# Altium project tPad_Yeongmi.PrjPcb
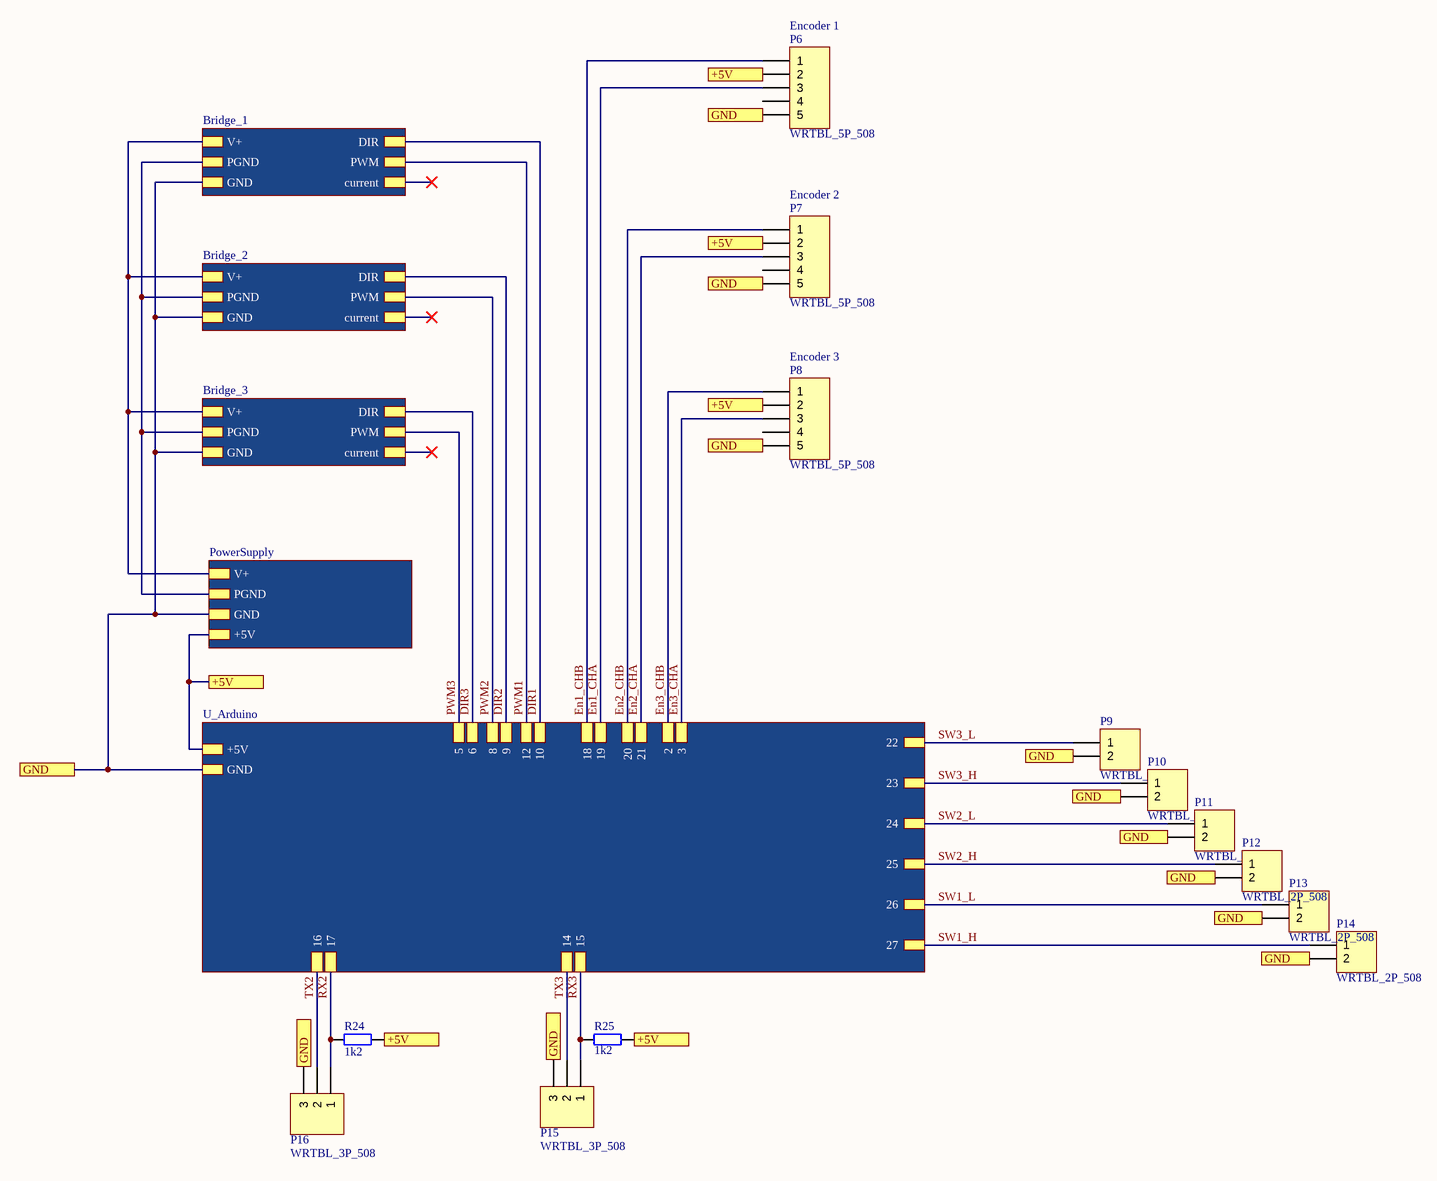
[diagram p0: Overview.SchDoc]
4 sheets, 136 parts. Net scope: hierarchical (ports join the sheet entries above them; power ports are global).
Board file: tPad_Yeongmi.PcbDoc
Sheets:
  Overview.SchDoc
    PowerSupply = PowerSupply.SchDoc
    Bridge_1 = OutputStage.SchDoc
    Bridge_2 = OutputStage.SchDoc
    Bridge_3 = OutputStage.SchDoc
    U_Arduino = Arduino.SchDoc

## Sheet Overview.SchDoc
size A3; Organization: MCI; SheetNumber: 1; SheetTotal: 1

### Parts
P6  WRTBL_5P_508  [WRTBL_5P_508]
P7  WRTBL_5P_508  [WRTBL_5P_508]
P8  WRTBL_5P_508  [WRTBL_5P_508]
P9  WRTBL_2P_508  [WRTBL_2P_508]
P10  WRTBL_2P_508  [WRTBL_2P_508]
P11  WRTBL_2P_508  [WRTBL_2P_508]
P12  WRTBL_2P_508  [WRTBL_2P_508]
P13  WRTBL_2P_508  [WRTBL_2P_508]
P14  WRTBL_2P_508  [WRTBL_2P_508]
P15  WRTBL_3P_508  [WRTBL_3P_508]
P16  WRTBL_3P_508  [WRTBL_3P_508]
R24  1k2  [_0603]
R25  1k2  [_0603]

### Sub-sheets
Bridge_1 = OutputStage.SchDoc: DIR, PWM, current, V+, PGND, GND
Bridge_2 = OutputStage.SchDoc: DIR, PWM, current, V+, PGND, GND
Bridge_3 = OutputStage.SchDoc: DIR, PWM, current, V+, PGND, GND
PowerSupply = PowerSupply.SchDoc: V+, +5V, GND, PGND
U_Arduino = Arduino.SchDoc: +5V, GND, 16, 17, 9, 12, 23, 2, 10, 8, 15, 3, 26, 25, 19, 24, 18, 27, 6, 22, 20, 5, 21, 14

### Ports
+5V, GND

### Nets
5V: P6.2 P7.2 P8.2 R24.2 R25.2 ; port +5V, sheet PowerSupply/+5V, sheet U_Arduino/+5V
GND: P6.5 P7.5 P8.5 P9.2 P10.2 P11.2 P12.2 P13.2 P14.2 P15.3 P16.3 ; port GND, sheet PowerSupply/GND, sheet Bridge_1/GND, sheet Bridge_2/GND, sheet Bridge_3/GND, sheet U_Arduino/GND
PGND: sheet PowerSupply/PGND, sheet Bridge_1/PGND, sheet Bridge_2/PGND, sheet Bridge_3/PGND
DIR1: sheet Bridge_1/DIR, sheet U_Arduino/10
DIR2: sheet Bridge_2/DIR, sheet U_Arduino/9
DIR3: sheet Bridge_3/DIR, sheet U_Arduino/6
En1_CHA: P6.3 ; sheet U_Arduino/19
En1_CHB: P6.1 ; sheet U_Arduino/18
En2_CHA: P7.3 ; sheet U_Arduino/21
En2_CHB: P7.1 ; sheet U_Arduino/20
En3_CHA: P8.3 ; sheet U_Arduino/3
En3_CHB: P8.1 ; sheet U_Arduino/2
PWM1: sheet Bridge_1/PWM, sheet U_Arduino/12
PWM2: sheet Bridge_2/PWM, sheet U_Arduino/8
PWM3: sheet Bridge_3/PWM, sheet U_Arduino/5
RX2: P16.1 R24.1 ; sheet U_Arduino/17
RX3: P15.1 R25.1 ; sheet U_Arduino/15
SW1_H: P14.1 ; sheet U_Arduino/27
SW1_L: P13.1 ; sheet U_Arduino/26
SW2_H: P12.1 ; sheet U_Arduino/25
SW2_L: P11.1 ; sheet U_Arduino/24
SW3_H: P10.1 ; sheet U_Arduino/23
SW3_L: P9.1 ; sheet U_Arduino/22
TX2: P16.2 ; sheet U_Arduino/16
TX3: P15.2 ; sheet U_Arduino/14
V+: sheet PowerSupply/V+, sheet Bridge_1/V+, sheet Bridge_2/V+, sheet Bridge_3/V+

Not connected (* = marked no-connect by the designer): P6 4; P7 4; P8 4

### Notes on the sheet
- (near P6) Encoder 1
- (near P7) Encoder 2
- (near P8) Encoder 3
- Project
- Date:
- Drawn by:
- Time:
- Number:
- Revision:
- Sheet
- of
- ELECTRONICS
- File:

### Library data of the parts
P6-P8 = Con_10: QR: 0; UID: Con_10; Name: WRTBL_5P_508; mounting: THT; Pins: 5
P9-P14 = Con_7: RS_number: 193-0586; QR: 0; UID: Con_7; Name: WRTBL_2P_508; Name_Hyperlink: Printklemme 5,08mm 2-polig; ComponentLink1URL: http://at.rs-online.com/web/search/searchBrowseAction.html?method=getProduct&R=1930586; mounting: THT; Pins: 2
P15 P16 = Con_8: QR: 0; UID: Con_8; Name: WRTBL_3P_508; mounting: THT; Pins: 3
R24 R25 = Res_5: Name: Res_0603; UID: Res_5; ComponentLink1URL: #VALUE!; mounting: SMD

## Sheet PowerSupply.SchDoc
size A3; Organization: MCI; SheetNumber: 1; SheetTotal: 1
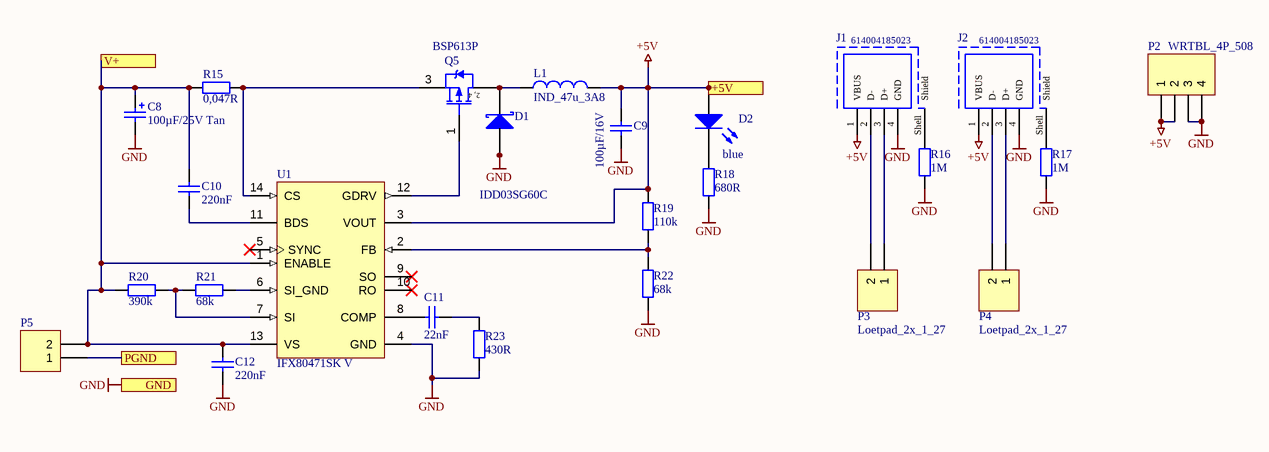
[diagram p1: PowerSupply.SchDoc]

### Parts
C8  100µF/25V Tan  [C]
C9  100µF/16V  [_1210]
C10  220nF  [_0805]
C11  22nF  [_0603]
C12  220nF  [_0805]
D1  IDD03SG60C  [TO_252]
D2  blue  [LED_0603]
J1  614004185023  [614004185023]
J2  614004185023  [614004185023]
L1  IND_47u_3A8  [WE_PD_XXL]
P2  WRTBL_4P_508  [WRTBL_4P_508]
P3  Loetpad_2x_1_27  [Loetpad_2x_1_27]
P4  Loetpad_2x_1_27  [Loetpad_2x_1_27]
P5  WRTBL_2P_508  [WRTBL_2P_508]  (value not drawn)
Q5  BSP613P  [INF-PG-SOT223_SC-73_N]
R15  0,047R  [_1206]
R16  1M  [_0603]
R17  1M  [_0603]
R18  680R  [_0603]
R19  110k  [_0603]
R20  390k  [_0603]
R21  68k  [_0603]
R22  68k  [_0603]
R23  430R  [_0603]
U1  IFX80471SK V  [INF-PG-DSO-14-1_N]

### Ports
+5V, GND, PGND, V+

### Nets
+5V: C9.2 D2.1 J1.1(VBUS) J2.1(VBUS) L1.2 P2.1 P2.2 R19.2 U1.3(VOUT) ; port +5V  [project net 5V]
GND: C8.2 C9.1 C12.1 D1.1 D1.2 J1.4(GND) J2.4(GND) P2.3 P2.4 R16.1 R17.1 R18.1 R22.1 R23.2 U1.4(GND) ; port GND
PGND: P5.1 ; port PGND
V+: C8.1 C10.2 C12.2 P5.2 R15.1 R20.1 U1.1(ENABLE) U1.13(VS) ; port V+
NetC10_1: C10.1 U1.11(BDS)
NetC11_1: C11.1 U1.8(COMP)
NetC11_2: C11.2 R23.1
NetD1_3: D1.3 L1.1 Q5.2(DRAIN) Q5.4(DRAIN)
NetD2_2: D2.2 R18.2
NetJ1_2: J1.2(D-) P3.2
NetJ1_3: J1.3(D+) P3.1
NetJ1_Shell: J1.Shell(Shield) R16.2
NetJ2_2: J2.2(D-) P4.2
NetJ2_3: J2.3(D+) P4.1
NetJ2_Shell: J2.Shell(Shield) R17.2
NetQ5_1: Q5.1(GATE) U1.12(GDRV)
NetQ5_3: Q5.3(SOURCE) R15.2 U1.14(CS)
NetR19_1: R19.1 R22.2 U1.2(FB)
NetR20_2: R20.2 R21.1 U1.7(SI)
NetR21_2: R21.2 U1.6(SI_GND)

Not connected (* = marked no-connect by the designer): U1 5(SYNC)* 9(SO)* 10(RO)*

### Notes on the sheet
- Project
- Date:
- Drawn by:
- Time:
- Number:
- Revision:
- Sheet
- of
- ELECTRONICS
- File:
- (in symbol Tran_33) 2, 4

### Library data of the parts
C8 = Cap_56: Name: Cap_tan_47u_25V; RS_number: 684-5284P; QR: 1; Capacity: 47u; Voltage: 25v; UID: Cap_56; Name_Hyperlink: Capacitor Tantalum SMT TR3D 25V 47uF; mounting: SMD
C9 = Cap_65: Name: Cap_1210; Capacity: ?F; Voltage: ?V; UID: Cap_65; mounting: SMD
C10 C12 = Cap_63: Name: Cap_0805; Capacity: ?F; Voltage: ?V; UID: Cap_63; mounting: SMD
C11 = Cap_129: Name: Cap_0603; QR: 0; UID: Cap_129; mounting: SMD
D1 = DIODE_12: Type: Schottky; Current / Power: 3.5 A; RS_number: 300-357P; QR: 0; UID: DIODE_12; Name: 30WQ06FN; Name_Hyperlink: Diode 30WQ06FN; mounting: SMD
D2 = DIODE_60: Name: LED_0603_blau; Colour: blau; RS_number: 697-3610P; QR: 0; UID: DIODE_60; Type: LED; Name_Hyperlink: http://at.rs-online.com/web/p/products/6973610P/; mounting: SMD
J1 J2 = 614004185023: USB 2.0 Type A Receptacle WR-COM, Vertical, THT, Short Type; Rated Current: 1.5 A; Contact Resistance: 30 mOhm; Working Voltage: 30 VAC; ComponentLink1Description: Manufacturer; ComponentLink1URL: http://www.we-online.de; ComponentLink2Description: Datasheet; ComponentLink2URL: https://katalog.we-online.de/em/datasheet/614004185023.pdf; Part Number: 614004185023; Published Date: September 2018; Publisher: Wurth Elektronik; Orientation: Vertical; Connector Type: USB 2.0 Type A; Operating Temperature: -55 to 85 degC; Mounting Technology: THT; Gender: Receptacle; Packaging: Tray
L1 = Ind_8: Inductor; Wuerth_number: 744 7709 470; QR: 0; Inductivity: 47 uH; Current: 3.8 A; UID: Ind_8; Name: IND_47u_3A8; mounting: SMD
P2 = Con_9: QR: 0; UID: Con_9; Name: WRTBL_4P_508; mounting: THT; Pins: 4
P3 P4 = Con_77: UID: Con_77; Name: Loetpad_2x_1_27; mounting: THT
P5 = Con_7: RS_number: 193-0586; QR: 0; UID: Con_7; Name: WRTBL_2P_508; Name_Hyperlink: Printklemme 5,08mm 2-polig; ComponentLink1URL: http://at.rs-online.com/web/search/searchBrowseAction.html?method=getProduct&R=1930586; mounting: THT; Pins: 2
Q5 = Tran_33: P-Channel SIPMOS Small-Signal-Transistor, -60 V VDS, -2.9 A ID, -55 to 150 degC, PG-SOT223 (SC-73), Reel, Green; Manufacturer: Infineon; Green: TRUE; ID (max): -2.9 A; IDpuls (max): -11.6 A; Mode: Enhancement; Polarity: P; Pto t (max): 1.8 W; QG: -22 nC; RDS (on) (max): 130 mOhm; Rth: 100 K/W; VDS (max): -60 V; VGS(th) (max): -4 V; VGS(th) (min): -2.1 V; DatasheetVersion: Rev. 2.7; PackageVersion: Apr-08; PackageReference: PG-SOT223 (SC-73); PackageDescription: 4-Pin Small Outline Transistor Package, 6.5 x 3.5 mm Body, 2.3 mm Pitch; Supplier 1: Digi-Key; Supplier Part Number 1: BSP613P-ND; Halogen-free: TRUE; Packing: Reel; Technology: SIPMOS; Mounting Technology: Surface Mount; PartNumber: BSP613P; ComponentLink1Description: Manufacturer URL; ComponentLink1URL: http://www.infineon.com/; ComponentLink2Description: Datasheet; ComponentLink2URL: http://www.infineon.com/dgdl/BSP613P_Rev2.7.pdf?folderId=db3a304314dca38901154a72e3951a65&fileId=db3a30433b47825b013b60ac86a96dc0; ComponentLink3Description: Package Specification; ComponentLink3URL: http://www.infineon.com/dgdl/SOT223-Package_Overview.pdf?folderId=db3a30431936bc4b0119530470b03c3d&fileId=db3a30431936bc4b0119531d40b93c5c; UID: Tran_33; Name: BSP613P; mounting: SMD; Type: P
R15 = Res_7: Name: Res_1206; UID: Res_7; mounting: SMD
R16-R23 = Res_5: Name: Res_0603; UID: Res_5; mounting: SMD
U1 = IFX80471SK V: Step-Down DC/DC Controller, 2,300 mA Iq, -40 to 125 degC, PG-DSO-14-1, Reel, Green; Manufacturer: Infineon; Green: TRUE; Iq (typ): 130 uA; Max Number Reflow: 3; Max Peak Reflow Temp: 260 degC; Output: Buck Converter; Tolerance: 3(5)%; VQ (max): adjustable; DatasheetVersion: Rev. 1.0; PackageVersion: Apr-11; PackageReference: PG-DSO-14-1; PackageDescription: 14-Pin Plastic (Green) Dual Small Outline Package, 8.65 x 3.9 mm Body, 1.27 mm Pitch; Supplier 1: Digi-Key; Supplier Part Number 1: IFX80471SK VINTR-ND; Supplier 2: Digi-Key; Supplier Part Number 2: IFX80471SK VINCT-ND; Supplier 3: Digi-Key; Supplier Part Number 3: IFX80471SK VINDKR-ND; Supplier 4: Mouser; Supplier Part Number 4: 726-IFX80471SKV; Halogen-free: TRUE; Inhibit: TRUE; IQ (max): 2,300 mA; MSL: 3; Packing: Reel; Protect: TRUE; Reset: TRUE; Mounting Technology: Surface Mount; PartNumber: IFX80471SK V; ComponentLink1Description: Manufacturer URL; ComponentLink1URL: http://www.infineon.com/; ComponentLink2Description: Datasheet; ComponentLink2URL: http://www.infineon.com/dgdl/DCDC-Controller-IFX80471-Data-Sheet-V10-Infineon.pdf?folderId=db3a304314dca3890115039cf70d0bf0&fileId=db3a30432e398416012e487ec6e42599; ComponentLink3Description: Package Specification; ComponentLink3URL: http://www.infineon.com/dgdl/DCDC-Controller-IFX80471-Data-Sheet-V10-Infineon.pdf?folderId=db3a304314dca3890115039cf70d0bf0&fileId=db3a30432e398416012e487ec6e42599

## Sheet OutputStage.SchDoc
size A3; Organization: MCI; SheetNumber: 1; SheetTotal: 1
Used 3 times, as channels Bridge_1, Bridge_2, Bridge_3. Parts and nets are listed once, with the designators drawn on the sheet.
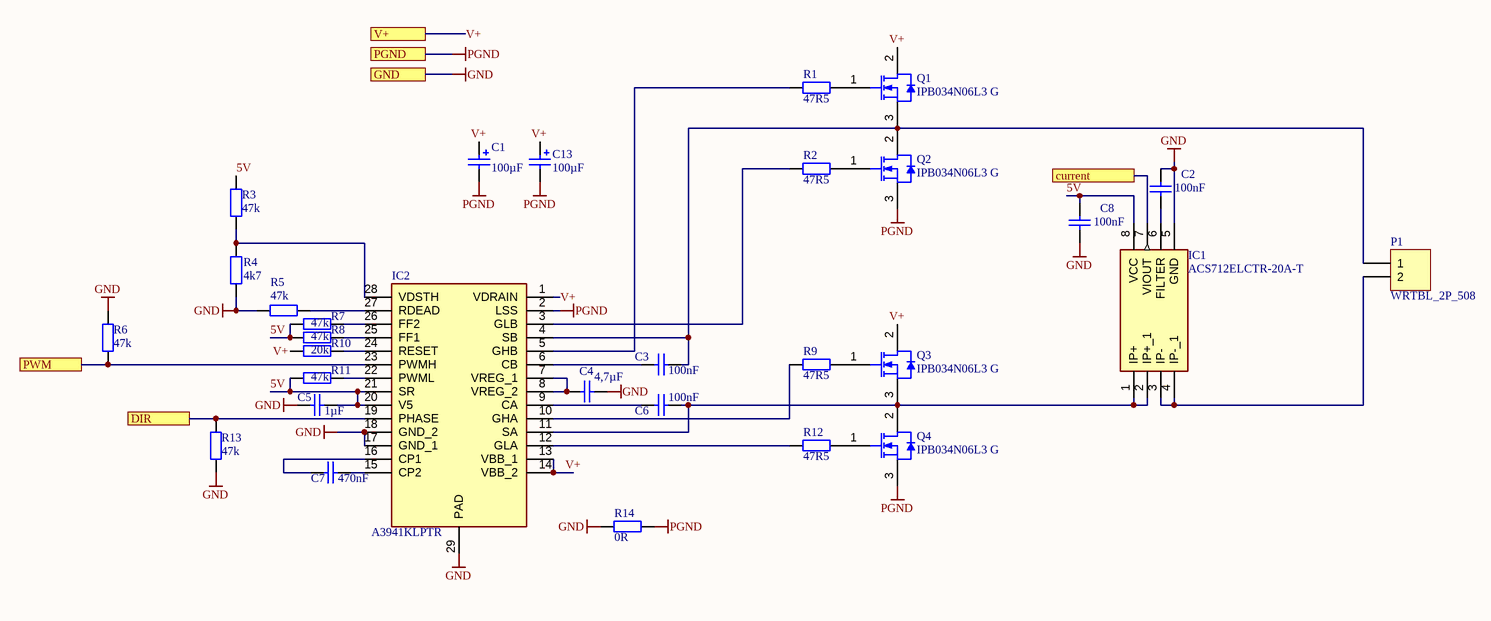
[diagram p2: OutputStage.SchDoc]

### Parts
C1  100µF  [Cap_THT_Elko_rad_D8mm]
C2  100nF  [_0603]
C3  100nF  [_0603]
C4  4,7µF  [_0603]
C5  1µF  [_0805]
C6  100nF  [_0603]
C7  470nF  [_0603]
C8  100nF  [_0603]
C13  100µF  [Cap_THT_Elko_rad_D8mm]
IC1  ACS712ELCTR-20A-T  [SOIC127P600X175-8N]
IC2  A3941KLPTR  [SOP65P640X120-29N]
P1  WRTBL_2P_508  [WRTBL_2P_508]
Q1  IPB034N06L3 G  [INF-PG-TO-263-3-2_A_N]
Q2  IPB034N06L3 G  [INF-PG-TO-263-3-2_A_N]
Q3  IPB034N06L3 G  [INF-PG-TO-263-3-2_A_N]
Q4  IPB034N06L3 G  [INF-PG-TO-263-3-2_A_N]
R1  47R5  [_0603]
R2  47R5  [_0603]
R3  47k  [_0603]
R4  4k7  [_0603]
R5  47k  [_0603]
R6  47k  [_0603]
R7  47k  [_0603]
R8  47k  [_0603]
R9  47R5  [_0603]
R10  20k  [_0603]
R11  47k  [_0603]
R12  47R5  [_0603]
R13  47k  [_0603]
R14  0R  [_0603]

### Ports
current, DIR, GND, PGND, PWM, V+

### Nets
GND: C2.2 C4.2 C5.1 C8.1 IC1.5(GND) IC2.17(GND_1) IC2.18(GND_2) IC2.29(PAD) R4.2 R5.2 R6.1 R13.2 R14.2 ; port GND
PGND: C1.2 C13.2 IC2.2(LSS) Q2.3(SOURCE) Q4.3(SOURCE) R14.1 ; port PGND
5V: C5.2 C8.2 IC1.8(VCC) IC2.20(V5) IC2.21(SR) R3.1 R7.2 R8.2 R11.2
current: IC1.7(VIOUT) ; port current
DIR: IC2.19(PHASE) R13.1 ; port DIR
PWM: IC2.23(PWMH) R6.2 ; port PWM
V+: C1.1 C13.1 IC2.1(VDRAIN) IC2.13(VBB_1) IC2.14(VBB_2) Q1.2(DRAIN) Q3.2(DRAIN) R10.2 ; port V+
NetC2_1: C2.1 IC1.6(FILTER)
NetC3_1: C3.1 IC2.6(CB)
NetC3_2: C3.2 IC2.4(SB) P1.1 Q1.3(SOURCE) Q2.2(DRAIN)
NetC4_1: C4.1 IC2.7(VREG_1) IC2.8(VREG_2)
NetC6_1: C6.1 IC2.9(CA)
NetC6_2: C6.2 IC1.1(IP+) IC1.2(IP+_1) IC2.11(SA) Q3.3(SOURCE) Q4.2(DRAIN)
NetC7_1: C7.1 IC2.16(CP1)
NetC7_2: C7.2 IC2.15(CP2)
NetIC1_3: IC1.3(IP-) IC1.4(IP-_1) P1.2
NetIC2_3: IC2.3(GLB) R2.2
NetIC2_5: IC2.5(GHB) R1.2
NetIC2_10: IC2.10(GHA) R9.2
NetIC2_12: IC2.12(GLA) R12.2
NetIC2_22: IC2.22(PWML) R11.1
NetIC2_24: IC2.24(RESET) R10.1
NetIC2_25: IC2.25(FF1) R8.1
NetIC2_26: IC2.26(FF2) R7.1
NetIC2_27: IC2.27(RDEAD) R5.1
NetIC2_28: IC2.28(VDSTH) R3.2 R4.1
NetQ1_1: Q1.1(GATE) R1.1
NetQ2_1: Q2.1(GATE) R2.1
NetQ3_1: Q3.1(GATE) R9.1
NetQ4_1: Q4.1(GATE) R12.1

### Channels
Bridge_1: designators end in _1; ports current=NetIC1_1_7 DIR=DIR1 GND=GND PGND=PGND PWM=PWM1 V+=V+
Bridge_2: designators end in _2; ports current=NetIC1_2_7 DIR=DIR2 GND=GND PGND=PGND PWM=PWM2 V+=V+
Bridge_3: designators end in _3; ports current=NetIC1_3_7 DIR=DIR3 GND=GND PGND=PGND PWM=PWM3 V+=V+

### Notes on the sheet
- Project
- Date:
- Drawn by:
- Time:
- Number:
- Revision:
- Sheet
- of
- ELECTRONICS
- File:

### Library data of the parts
C1 C13 = Cap_15: Name: Cap_Elko_rad_100u_35V; RS_number: 228-6767; QR: 1; ax_rad: rad; Capacity: 100u; Voltage: 35V; UID: Cap_15; Name_Hyperlink: Elko 100µF 35VDC; ComponentLink1URL: http://de.rs-online.com/web/search/searchBrowseAction.html?method=getProduct&R=2286767; mounting: THT
C2-C4 C6-C8 = Cap_129: Name: Cap_0603; QR: 0; UID: Cap_129; mounting: SMD
C5 = Cap_128: Name: Cap_0805; QR: 0; UID: Cap_128; ComponentLink1URL: #VALUE!; mounting: SMD
IC1 = ACS712ELCTR-20A-T: Integrated Circuit; Manufacturer_Name: Allegro Microsystems; Allied_Number: R1076682; Datasheet Link: http://uk.rs-online.com/web/p/products/6807135P; Height: 1.75mm; RS Part Number: 6807135P; RS Price/Stock: http://uk.rs-online.com/web/p/products/6807135P; Manufacturer_Part_Number: ACS712ELCTR-20A-T
IC2 = A3941KLPTR: Integrated Circuit; Manufacturer_Name: Allegro Microsystems; Datasheet Link: http://uk.rs-online.com/web/p/products/7248704; Height: 1.2mm; Manufacturer_Part_Number: A3941KLPTR; RS Part Number: 7248704P; RS Price/Stock: http://uk.rs-online.com/web/p/products/7248704P
P1 = Con_7: RS_number: 193-0586; QR: 0; UID: Con_7; Name: WRTBL_2P_508; Name_Hyperlink: Printklemme 5,08mm 2-polig; ComponentLink1URL: http://at.rs-online.com/web/search/searchBrowseAction.html?method=getProduct&R=1930586; mounting: THT; Pins: 2
Q1-Q4 = IPB034N06L3 G: N-Channel OptiMOS 3 Power-Transistor, 60 V VDS, 90 A ID, -55 to 175 degC, PG-TO-263-3-2, Reel, Green; Manufacturer: Infineon; Green: TRUE; ID (max): 90 A; IDpuls (max): 360 A; Polarity: N; Ptot (max): 167 W; QG: 59 nC; RDS (on) (max): 3.7 mOhm; RDS (on) (max) (@4.5V): 5.7 mOhm; Rth: 0.9 K/W; RthJA (max): 62 K/W; VDS (max): 60 V; VGS(th) (max): 2.2 V; VGS(th) (min): 1.2 V; DatasheetVersion: Rev. 2.7; PackageVersion: Rev. 01, 08/2007; PackageReference: PG-TO-263-3-2; PackageDescription: 3-Pin Plastic (Green) Transistor Single Outline Package, 10.06 x 8.98 mm Body, 2.54 mm Pitch; Supplier 1: Digi-Key; Supplier Part Number 1: IPB034N06L3 GTR-ND; Supplier 2: Digi-Key; Supplier Part Number 2: IPB034N06L3 GCT-ND; Supplier 3: Digi-Key; Supplier Part Number 3: IPB034N06L3 GDKR-ND; Supplier 4: Mouser; Supplier Part Number 4: 726-IPB034N06L3G; Halogen-free: TRUE; Packing: Reel; RthJC (max): 0.9 K/W; Mounting Technology: Surface Mount; PartNumber: IPB034N06L3 G; ComponentLink1Description: Manufacturer URL; ComponentLink1URL: http://www.infineon.com/; ComponentLink2Description: Datasheet; ComponentLink2URL: http://www.infineon.com/dgdl/IPP037N06L3_Rev2.7.pdf?folderId=db3a304313b8b5a60113cee8763b02d7&fileId=db3a30431b3e89eb011b4561341f7d38; ComponentLink3Description: Package Specification; ComponentLink3URL: http://www.infineon.com/dgdl/IPB026N06N_Rev2.2.pdf?folderId=db3a304313b8b5a60113cee8763b02d7&fileId=db3a3043372d5cc8013754c7b2a74f7c
R1-R14 = Res_5: Name: Res_0603; UID: Res_5; mounting: SMD

## Sheet Arduino.SchDoc
size A3; Organization: MCI; SheetNumber: 1; SheetTotal: 1
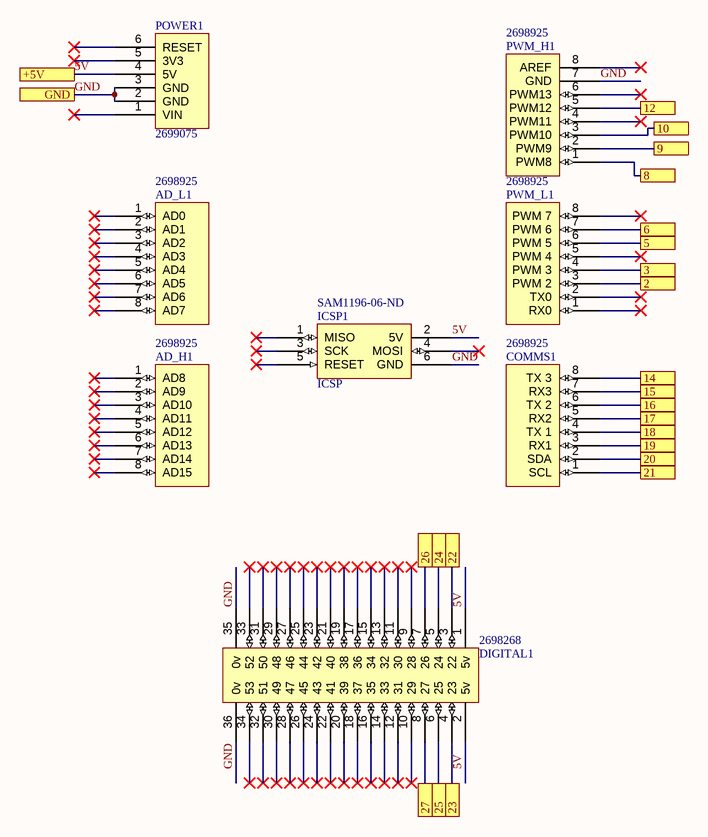
[diagram p3: Arduino.SchDoc]

### Parts
AD_H1  Supplier Part Number 4: 2698925  [Header 8x1 8.5mm]  (hidden comment: AD_H)
AD_L1  Supplier Part Number 5: 2698925  [Header 8x1 8.5mm]  (hidden comment: AD_L)
COMMS1  Supplier Part Number 4: 2698925  [Header 8x1 8.5mm]  (hidden comment: Communication)
DIGITAL1  Supplier Part Number 5: 2698268  [HEADER 36X 8MM]  (hidden comment: IO_36)
ICSP1  ICSP  Supplier Part Number 5: SAM1196-06-ND  [ICSP]
POWER1  Supplier Part Number 2: 2699075  [Header 6x1 8.5mm]  (hidden comment: POWER)
PWM_H1  Supplier Part Number 4: 2698925  [Header 8x1 8.5mm]  (hidden comment: PWM_H)
PWM_L1  Supplier Part Number 4: 2698925  [Header 8x1 8.5mm]  (hidden comment: PWM_L)

### Ports
2, 3, 5, 6, 8, 9, 10, 12, 14, 15, 16, 17, 18, 19, 20, 21, 22, 23, 24, 25, 26, 27, +5V, GND

### Nets
5V: DIGITAL1.1(5v) DIGITAL1.2(5v) ICSP1.2(5V) POWER1.4(5V) ; port +5V
GND: DIGITAL1.35(0v) DIGITAL1.36(0v) ICSP1.6(GND) POWER1.2(GND) POWER1.3(GND) PWM_H1.7(GND) ; port GND
DIR1: PWM_H1.3(PWM10) ; port 10
DIR2: PWM_H1.2(PWM9) ; port 9
DIR3: PWM_L1.7(PWM_6) ; port 6
En1_CHA: COMMS1.3(RX1) ; port 19
En1_CHB: COMMS1.4(TX_1) ; port 18
En2_CHA: COMMS1.1(SCL) ; port 21
En2_CHB: COMMS1.2(SDA) ; port 20
En3_CHA: PWM_L1.4(PWM_3) ; port 3
En3_CHB: PWM_L1.3(PWM_2) ; port 2
PWM1: PWM_H1.5(PWM12) ; port 12
PWM2: PWM_H1.1(PWM8) ; port 8
PWM3: PWM_L1.6(PWM_5) ; port 5
RX2: COMMS1.5(RX2) ; port 17
RX3: COMMS1.7(RX3) ; port 15
SW1_H: DIGITAL1.8(27) ; port 27
SW1_L: DIGITAL1.7(26) ; port 26
SW2_H: DIGITAL1.6(25) ; port 25
SW2_L: DIGITAL1.5(24) ; port 24
SW3_H: DIGITAL1.4(23) ; port 23
SW3_L: DIGITAL1.3(22) ; port 22
TX2: COMMS1.6(TX_2) ; port 16
TX3: COMMS1.8(TX_3) ; port 14

Not connected (* = marked no-connect by the designer): AD_H1 1(AD8)* 2(AD9)* 3(AD10)* 4(AD11)* 5(AD12)* 6(AD13)* 7(AD14)* 8(AD15)*; AD_L1 1(AD0)* 2(AD1)* 3(AD2)* 4(AD3)* 5(AD4)* 6(AD5)* 7(AD6)* 8(AD7)*; DIGITAL1 9(28)* 10(29)* 11(30)* 12(31)* 13(32)* 14(33)* 15(34)* 16(35)* 17(36)* 18(37)* 19(38)* 20(39)* 21(40)* 22(41)* 23(42)* 24(43)* 25(44)* 26(45)* 27(46)* 28(47)* 29(48)* 30(49)* 31(50)* 32(51)* 33(52)* 34(53)*; ICSP1 1(MISO)* 3(SCK)* 4(MOSI)* 5(RESET)*; POWER1 1(VIN)* 5(3V3)* 6(RESET)*; PWM_H1 4(PWM11)* 6(PWM13)* 8(AREF)*; PWM_L1 1(RX0)* 2(TX0)* 5(PWM_4)* 8(PWM_7)*

### Notes on the sheet
- Project
- Date:
- Drawn by:
- Time:
- Number:
- Revision:
- Sheet
- of
- ELECTRONICS
- File:

### Library data of the parts
AD_H1 = AD_H: Supplier 1: Arrow; Supplier Part Number 1: 2698940; Supplier 2: Arrow; Supplier Part Number 2: 2698939; Supplier 3: Digi-Key; Supplier Part Number 3: SAM1198-08-ND; Supplier 4: Arrow
AD_L1 = AD_L: Supplier 1: Digi-Key; Supplier Part Number 1: SAM1198-08-ND; Supplier 2: Arrow; Supplier Part Number 2: 2698939; Supplier 3: Arrow; Supplier Part Number 3: 2698940; Supplier 4: Arrow; Supplier Part Number 4: 43085273; Supplier 5: Arrow
COMMS1 = Communication: Supplier 1: Digi-Key; Supplier Part Number 1: SAM1198-08-ND; Supplier 2: Arrow; Supplier Part Number 2: 2698940; Supplier 3: Arrow; Supplier Part Number 3: 2698939; Supplier 4: Arrow
DIGITAL1 = IO_36: Supplier 1: Digi-Key; Supplier Part Number 1: SAM1196-18-ND; Supplier 2: Arrow; Supplier Part Number 2: 48117090; Supplier 3: Arrow; Supplier Part Number 3: 46093326; Supplier 4: Arrow; Supplier Part Number 4: 2698278; Supplier 5: Arrow
ICSP1 = ICSP: Supplier 1: Digi-Key; Supplier Part Number 1: SAM1185-06-ND; Supplier 2: Arrow; Supplier Part Number 2: 2699117; Supplier 3: Arrow; Supplier Part Number 3: 43862781; Supplier 4: Arrow; Supplier Part Number 4: 2699091; Supplier 5: Digi-Key
POWER1 = POWER: Supplier 1: Arrow; Supplier Part Number 1: 52553843; Supplier 2: Arrow; Supplier 3: Digi-Key; Supplier Part Number 3: SAM1198-06-ND; Supplier 4: Arrow; Supplier Part Number 4: 2699089; Supplier 5: Arrow; Supplier Part Number 5: 2699088
PWM_H1 = PWM_H: Supplier 1: Digi-Key; Supplier Part Number 1: SAM1198-08-ND; Supplier 2: Arrow; Supplier Part Number 2: 2698940; Supplier 3: Arrow; Supplier Part Number 3: 2698939; Supplier 4: Arrow
PWM_L1 = PWM_L: Supplier 1: Arrow; Supplier Part Number 1: 2698940; Supplier 2: Arrow; Supplier Part Number 2: 2698939; Supplier 3: Digi-Key; Supplier Part Number 3: SAM1198-08-ND; Supplier 4: Arrow

## Nets that join several sheets
5V: Overview (5 pins), PowerSupply (9 pins), Arduino (DIGITAL1.1 DIGITAL1.2 ICSP1.2 POWER1.4)
GND: Overview (11 pins), PowerSupply (15 pins), Bridge_1 (13 pins), Bridge_2 (13 pins), Bridge_3 (13 pins), Arduino (6 pins)
PGND: PowerSupply (P5.1), Bridge_1 (6 pins), Bridge_2 (6 pins), Bridge_3 (6 pins)
DIR1: Bridge_1 (IC2_1.19 R13_1.1), Arduino (PWM_H1.3)
DIR2: Bridge_2 (IC2_2.19 R13_2.1), Arduino (PWM_H1.2)
DIR3: Bridge_3 (IC2_3.19 R13_3.1), Arduino (PWM_L1.7)
En1_CHA: Overview (P6.3), Arduino (COMMS1.3)
En1_CHB: Overview (P6.1), Arduino (COMMS1.4)
En2_CHA: Overview (P7.3), Arduino (COMMS1.1)
En2_CHB: Overview (P7.1), Arduino (COMMS1.2)
En3_CHA: Overview (P8.3), Arduino (PWM_L1.4)
En3_CHB: Overview (P8.1), Arduino (PWM_L1.3)
PWM1: Bridge_1 (IC2_1.23 R6_1.2), Arduino (PWM_H1.5)
PWM2: Bridge_2 (IC2_2.23 R6_2.2), Arduino (PWM_H1.1)
PWM3: Bridge_3 (IC2_3.23 R6_3.2), Arduino (PWM_L1.6)
RX2: Overview (P16.1 R24.1), Arduino (COMMS1.5)
RX3: Overview (P15.1 R25.1), Arduino (COMMS1.7)
SW1_H: Overview (P14.1), Arduino (DIGITAL1.8)
SW1_L: Overview (P13.1), Arduino (DIGITAL1.7)
SW2_H: Overview (P12.1), Arduino (DIGITAL1.6)
SW2_L: Overview (P11.1), Arduino (DIGITAL1.5)
SW3_H: Overview (P10.1), Arduino (DIGITAL1.4)
SW3_L: Overview (P9.1), Arduino (DIGITAL1.3)
TX2: Overview (P16.2), Arduino (COMMS1.6)
TX3: Overview (P15.2), Arduino (COMMS1.8)
V+: PowerSupply (8 pins), Bridge_1 (8 pins), Bridge_2 (8 pins), Bridge_3 (8 pins)